# EasyEDA schematic table2.json
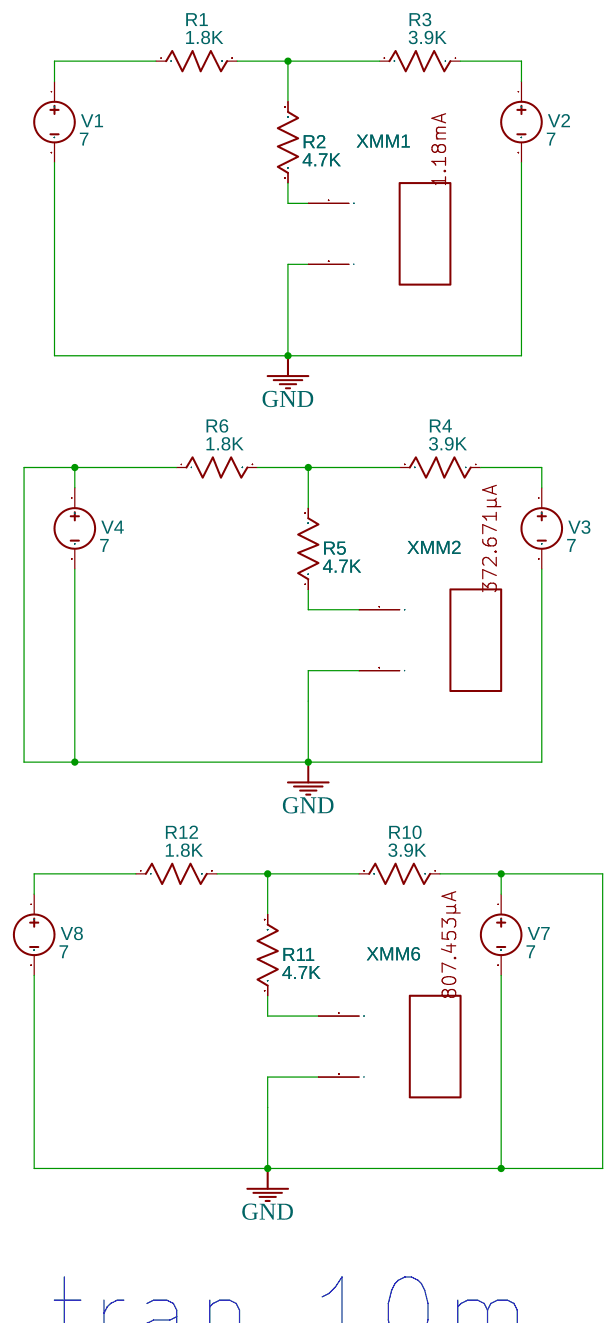
[diagram p0: schematic sheet]

## Parts
R1  1.8K  [AXIAL-0.3]
R2  4.7K  [AXIAL-0.3]
R3  3.9K  [AXIAL-0.3]
R4  3.9K  [AXIAL-0.3]
R5  4.7K  [AXIAL-0.3]
R6  1.8K  [AXIAL-0.3]
R10  3.9K  [AXIAL-0.3]
R11  4.7K  [AXIAL-0.3]
R12  1.8K  [AXIAL-0.3]
V1  7  [HDR1X2]
V2  7  [HDR1X2]
V3  7  [HDR1X2]
V4  7  [HDR1X2]
V7  7  [HDR1X2]
V8  7  [HDR1X2]
XMM1  Multimeter
XMM2  Multimeter
XMM6  Multimeter

## Library data of the parts
R1-R6 R10-R12 = Resistor_US: Resistance: 1k; Contributor: EasyEDA; Supplier: YUJING
V1-V4 V7 V8 = VDC: Contributor: EasyEDA; sim: true
XMM1 XMM2 XMM6 = MULTIMETER: Supplier: LCSC; Multimeter Type: Amper; Power Type: AC; Voltmeter resistance: 10μ; Ammeter resistance: 1G; NameDisplay: 0; Contributor: EasyEDA; sim: true

## Nets
GND: R6.1 R10.1 V1.2 V2.2 V3.2 V4.1 V4.2 V7.1 V7.2 V8.2 XMM1.2(I) XMM2.2(I) XMM6.2(I)
Net-(R1-1): R1.1 V1.1
Net-(R1-2): R1.2 R2.2 R3.2
Net-(R2-1): R2.1 XMM1.1(+)
Net-(R3-1): R3.1 V2.1
Net-(R4-1): R4.1 V3.1
Net-(R4-2): R4.2 R5.2 R6.2
Net-(R5-1): R5.1 XMM2.1(+)
Net-(R10-2): R10.2 R11.2 R12.2
Net-(R11-1): R11.1 XMM6.1(+)
Net-(R12-1): R12.1 V8.1

## Notes on the sheet
- .tran 10m
